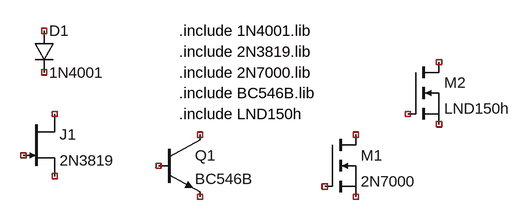
[diagram p0: schematic TP_FE.asc]
TP_FE.asc, the LTspice schematic file:
Version 4.1
SHEET 1 880 680
SYMBOL diode 80 96 R0
SYMATTR InstName D1
SYMATTR Value 1N4001
SYMBOL njf 64 224 R0
SYMATTR InstName J1
SYMATTR Value 2N3819
SYMBOL npn 272 256 R0
SYMATTR InstName Q1
SYMATTR Value BC546B
SYMBOL nmos 528 256 R0
SYMATTR InstName M1
SYMATTR Value 2N7000
SYMBOL nmos 656 144 R0
SYMATTR InstName M2
SYMATTR Value LND150h
TEXT 304 96 Left 2 !.include 1N4001.lib
TEXT 304 128 Left 2 !.include 2N3819.lib
TEXT 304 160 Left 2 !.include 2N7000.lib
TEXT 304 192 Left 2 !.include BC546B.lib
TEXT 304 224 Left 2 !.include LND150h

The netlist it stands for:
* TP_FE.asc
D1 NC_01 NC_02 1N4001
J1 NC_03 NC_04 NC_05 2N3819
Q1 NC_06 NC_07 NC_08 0 BC546B
M1 NC_09 NC_10 NC_11 NC_11 2N7000
M2 NC_12 NC_13 NC_14 NC_14 LND150h
.model D D
.lib standard.dio
.model NPN NPN
.model PNP PNP
.lib standard.bjt
.model NJF NJF
.model PJF PJF
.lib standard.jft
.model NMOS NMOS
.model PMOS PMOS
.lib standard.mos
.include 1N4001.lib
.include 2N3819.lib
.include 2N7000.lib
.include BC546B.lib
.include LND150h
.backanno
.end